# Altium schematic sheet MAIN.SchDoc
size A3; DocumentNumber: 1; SheetNumber: 1; SheetTotal: 2
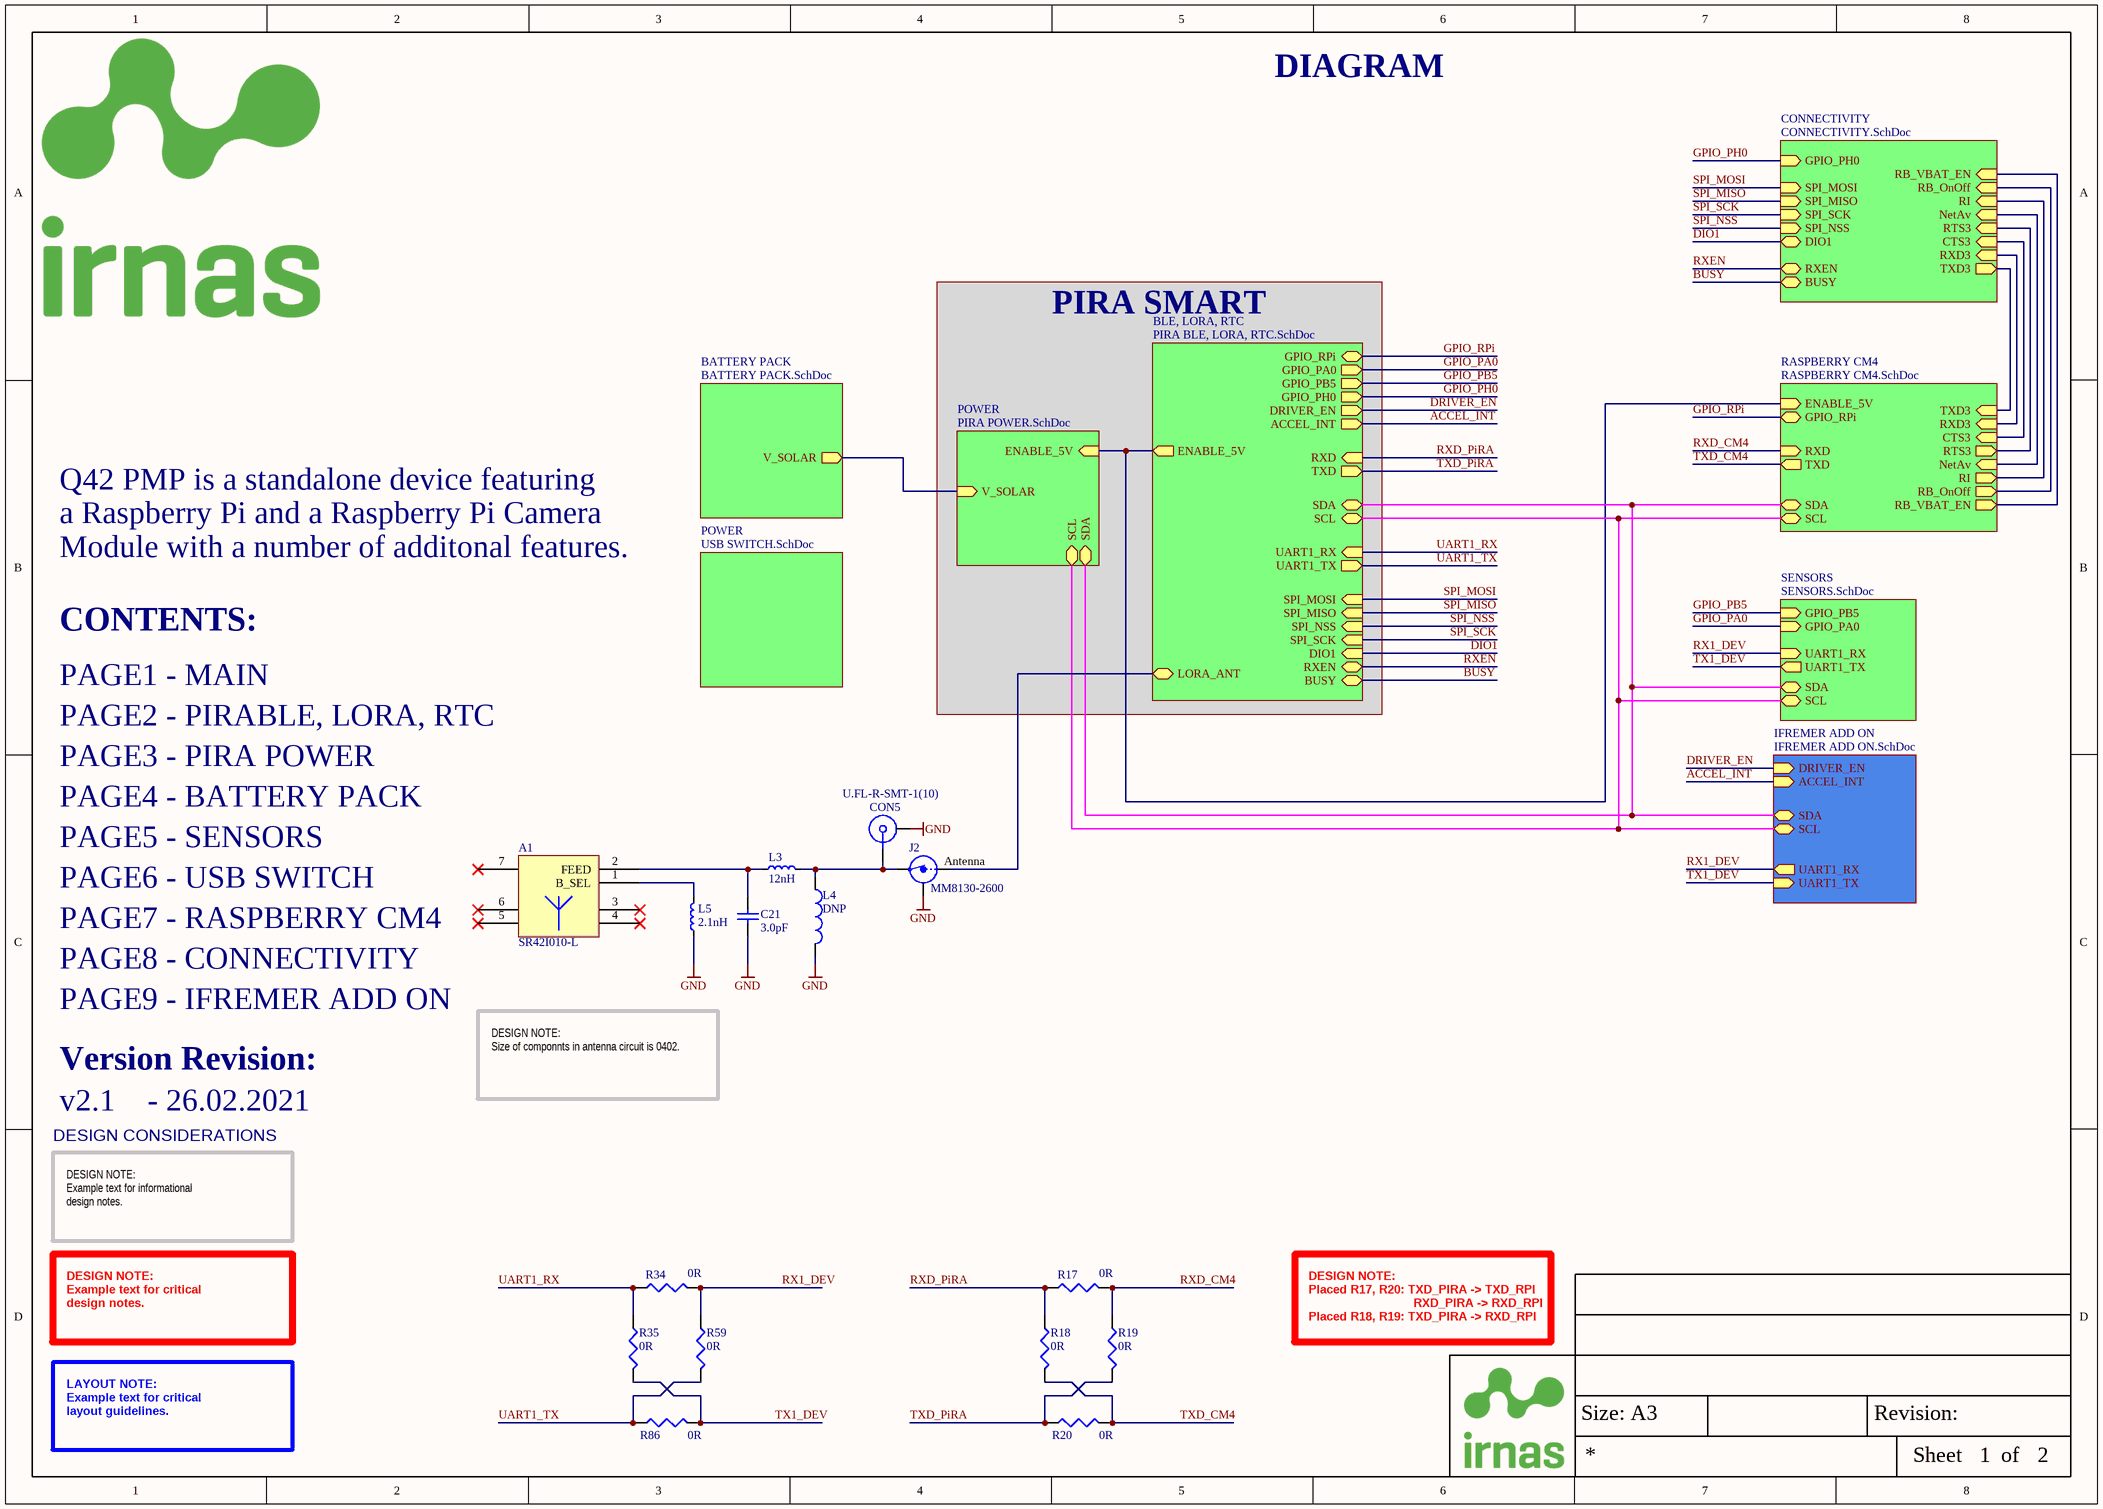
[diagram p0: MAIN.SchDoc]

## Parts
A1  SR42I010-L  [SR42I010-L]
C21  value 3.0pF  [CAP0402]  (hidden comment: 3.0pF/50V/0402)
CON5  U.FL-R-SMT-1(10)  [ufl connector smd]
J2  MM8130-2600  [COAXIAL-SWF]
L3  value 12nH  [IND0402]  (hidden comment: 10nH/0402)
L4  DNP  [IND0402]
L5  2.1nH  [IND0402]
R17  0R  [RES0603]
R18  0R  [RES0603]
R19  0R  [RES0603]
R20  0R  [RES0603]
R34  0R  [RES0603]
R35  0R  [RES0603]
R59  0R  [RES0603]
R86  0R  [RES0603]

## Sub-sheets
BATTERY PACK = BATTERY PACK.SchDoc: V_SOLAR (out)
BLE, LORA, RTC = PIRA BLE, LORA, RTC.SchDoc: ENABLE_5V (out), SDA (bidir), UART1_RX (in), SCL (bidir), UART1_TX (out), GPIO_PH0 (out), LORA_ANT (bidir), GPIO_PB5 (out), TXD (out), RXD (in), RXEN (bidir), BUSY (bidir), GPIO_PA0 (out), DRIVER_EN (out), ACCEL_INT (out), GPIO_RPi (bidir), SPI_SCK (in), SPI_MISO (in), DIO1 (in), SPI_MOSI (in), SPI_NSS (in)
CONNECTIVITY = CONNECTIVITY.SchDoc: TXD3 (out), RXD3 (in), GPIO_PH0 (in), RB_VBAT_EN (in), RI (in), CTS3 (in), NetAv (in), RXEN (bidir), RB_OnOff (in), BUSY (bidir), DIO1 (bidir), SPI_NSS (in), SPI_MISO (in), SPI_MOSI (in), RTS3 (in), SPI_SCK (in)
IFREMER ADD ON = IFREMER ADD ON.SchDoc: DRIVER_EN (in), UART1_TX (in), SCL (bidir), SDA (bidir), ACCEL_INT (in), UART1_RX (out)
POWER = PIRA POWER.SchDoc: ENABLE_5V (in), SCL (bidir), SDA (bidir), V_SOLAR (in)
POWER = USB SWITCH.SchDoc: no entries
RASPBERRY CM4 = RASPBERRY CM4.SchDoc: CTS3 (in), RB_OnOff (out), SDA (bidir), TXD (out), RTS3 (out), ENABLE_5V (in), TXD3 (in), RB_VBAT_EN (out), NetAv (in), RI (out), GPIO_RPi (bidir), RXD (in), SCL (bidir), RXD3 (in)
SENSORS = SENSORS.SchDoc: SDA (bidir), UART1_RX (in), SCL (bidir), GPIO_PB5 (in), GPIO_PA0 (in), UART1_TX (out)

## Nets
GND: C21.1 CON5.2 J2.2(Shield) L4.1 L5.1
ACCEL_INT: sheet BLE, LORA, RTC/ACCEL_INT, sheet IFREMER ADD ON/ACCEL_INT
BUSY: sheet BLE, LORA, RTC/BUSY, sheet CONNECTIVITY/BUSY
DIO1: sheet BLE, LORA, RTC/DIO1, sheet CONNECTIVITY/DIO1
DRIVER_EN: sheet BLE, LORA, RTC/DRIVER_EN, sheet IFREMER ADD ON/DRIVER_EN
GPIO_PA0: sheet SENSORS/GPIO_PA0, sheet BLE, LORA, RTC/GPIO_PA0
GPIO_PB5: sheet SENSORS/GPIO_PB5, sheet BLE, LORA, RTC/GPIO_PB5
GPIO_PH0: sheet BLE, LORA, RTC/GPIO_PH0, sheet CONNECTIVITY/GPIO_PH0
GPIO_RPi: sheet BLE, LORA, RTC/GPIO_RPi, sheet RASPBERRY CM4/GPIO_RPi
RX1_DEV: R34.2 R59.1 ; sheet SENSORS/UART1_RX, sheet IFREMER ADD ON/UART1_RX
RXD_CM4: R17.2 R19.1 ; sheet RASPBERRY CM4/RXD
RXD_PiRA: R17.1 R18.1 ; sheet BLE, LORA, RTC/RXD
RXEN: sheet BLE, LORA, RTC/RXEN, sheet CONNECTIVITY/RXEN
SPI_MISO: sheet BLE, LORA, RTC/SPI_MISO, sheet CONNECTIVITY/SPI_MISO
SPI_MOSI: sheet BLE, LORA, RTC/SPI_MOSI, sheet CONNECTIVITY/SPI_MOSI
SPI_NSS: sheet BLE, LORA, RTC/SPI_NSS, sheet CONNECTIVITY/SPI_NSS
SPI_SCK: sheet BLE, LORA, RTC/SPI_SCK, sheet CONNECTIVITY/SPI_SCK
TX1_DEV: R35.2 R86.2 ; sheet SENSORS/UART1_TX, sheet IFREMER ADD ON/UART1_TX
TXD_CM4: R18.2 R20.2 ; sheet RASPBERRY CM4/TXD
TXD_PiRA: R19.2 R20.1 ; sheet BLE, LORA, RTC/TXD
UART1_RX: R34.1 R35.1 ; sheet BLE, LORA, RTC/UART1_RX
UART1_TX: R59.2 R86.1 ; sheet BLE, LORA, RTC/UART1_TX
NetA1_1: A1.1(B_SEL) L5.2
NetA1_2: A1.2(FEED) C21.2 L3.1
NetCON5_1: CON5.1 J2.3(OUT) L3.2 L4.2
NetJ2_1: J2.1(IN) ; sheet BLE, LORA, RTC/LORA_ANT
(unnamed): sheet BATTERY PACK/V_SOLAR, sheet POWER/V_SOLAR
(unnamed): sheet SENSORS/SDA, sheet POWER/SDA, sheet BLE, LORA, RTC/SDA, sheet IFREMER ADD ON/SDA, sheet RASPBERRY CM4/SDA
(unnamed): sheet SENSORS/SCL, sheet POWER/SCL, sheet BLE, LORA, RTC/SCL, sheet IFREMER ADD ON/SCL, sheet RASPBERRY CM4/SCL
(unnamed): sheet POWER/ENABLE_5V, sheet BLE, LORA, RTC/ENABLE_5V, sheet RASPBERRY CM4/ENABLE_5V
(unnamed): sheet CONNECTIVITY/TXD3, sheet RASPBERRY CM4/TXD3
(unnamed): sheet CONNECTIVITY/RXD3, sheet RASPBERRY CM4/RXD3
(unnamed): sheet CONNECTIVITY/RB_VBAT_EN, sheet RASPBERRY CM4/RB_VBAT_EN
(unnamed): sheet CONNECTIVITY/RI, sheet RASPBERRY CM4/RI
(unnamed): sheet CONNECTIVITY/CTS3, sheet RASPBERRY CM4/CTS3
(unnamed): sheet CONNECTIVITY/NetAv, sheet RASPBERRY CM4/NetAv
(unnamed): sheet CONNECTIVITY/RB_OnOff, sheet RASPBERRY CM4/RB_OnOff
(unnamed): sheet CONNECTIVITY/RTS3, sheet RASPBERRY CM4/RTS3

Not connected (* = marked no-connect by the designer): A1 3* 4* 5* 6* 7*

## Notes on the sheet
- DIAGRAM
- PIRA SMART
- Q42 PMP is a standalone device featuring
- a Raspberry Pi and a Raspberry Pi Camera
- Module with a number of additonal features.
- CONTENTS:
- PAGE1 - MAIN
- PAGE2 - PIRABLE, LORA, RTC
- PAGE3 - PIRA POWER
- PAGE4 - BATTERY PACK
- PAGE5 - SENSORS
- PAGE6 - USB SWITCH
- PAGE7 - RASPBERRY CM4
- PAGE8 - CONNECTIVITY
- PAGE9 - IFREMER ADD ON
- Version Revision:
- v2.1    - 26.02.2021
- DESIGN NOTE:
  Size of componnts in antenna circuit is 0402.
- DESIGN CONSIDERATIONS
- DESIGN NOTE:
  Example text for informational
  design notes.
- DESIGN NOTE:
  Example text for critical
  design notes.
- DESIGN NOTE:
  Placed R17, R20: TXD_PIRA -> TXD_RPI
  RXD_PIRA -> RXD_RPI
  Placed R18, R19: TXD_PIRA -> RXD_RPI
  RXD_PIRA -> TXD_RPI
- LAYOUT NOTE:
  Example text for critical
  layout guidelines.
- Size: A3
- Revision:
- Sheet
- of
- (in symbol Coaxial-Internal-SW) Antenna

## Library data of the parts
A1 = ANT - SR42I010-R_1: Antenna SMD -4dBi Gain 870MHz/928MHz Automotive 7-Pin SMD T/R; Manufacturer: Antenova; Supplier 1: Mouser; Manufacturer Part Number: SR42I010-R; Stock 1: 3154; Pricing 1: 1 = 2.36000, 10 = 1.90000, 50 = 1.90000, 100 = 1.52000, 1000 = 1.07000, 10000 = 0.95900 (USD); Supplier Part Number 1: 237-SR42I010-R
C21 = C - 3.0pF/50V/0402: CAP CER 3.0PF 50V C0G/NP0 0402; Published: 8-Jun-2000; LatestRevisionDate: 05-oct-2007  -  Semtech; LatestRevisionNote: Re-released for DXP Platform.; Publisher: Altium Limited; Supplier 1: Digi-Key; Supplier Part Number 1: 490-7756-1-ND
CON5 = U.FL-R-SMT-1(10): RF / Coaxial Connector, U.FL Coaxial, Straight Jack, Surface Mount Vertical, 50 ohm, Brass; Manufacturer: Hirose; Featured Product: U.FL Series Connectors; Connector Style: U.FL, Ultra Miniature Coaxial; Connector Type: Receptacle, Male Pin; Contact Termination: Solder; Impedance: 50 Ohm; Frequency - Max: 6GHz; Body Material: Phosphor Bronze; Body Finish: Silver; Center Contact Plating: Gold; Dielectric Material: Liquid Crystal Polymer (LCP); Online Catalog: UMCC (Ultra Miniature Coax Connectors), U.FL Series; Other Names: H11891TR  Q5400621  U.FL-R-SMT-1 10  U.FL-R-SMT-1(10)-ND  UFLRSMT110; Supplier 1: Farnell; Manufacturer Part Number: U.FL-R-SMT-1(10); Stock 1: 0; Standard Package: 2,500; Category: Connectors, Interconnects; Family: Coaxial Connectors (RF); Series: U.FL; Packaging: Tape & Reel (TR); Shield Termination: Solder; Mounting Type: Surface Mount; Cable Group: -; Fastening Type: Snap-On; Features: -; Housing Color: Beige; Ingress Protection: -; Center Contact Material: Brass; Voltage Rating: -; Operating Temperature: -40°C ~ 90°C; ComponentLink1URL: http://www.farnell.com/datasheets/91524.pdf; ComponentLink1Description: http://www.farnell.com/datasheets/91524.pdf; ComponentLink2URL: http://uk.rs-online.com/webdocs/1363/0900766b81363563.pdf; ComponentLink2Description: http://uk.rs-online.com/webdocs/1363/0900766b81363563.pdf; ComponentLink3URL: http://www.farnell.com/datasheets/1947917.pdf; ComponentLink3Description: http://www.farnell.com/datasheets/1947917.pdf; Supplier Part Number 1: 1688077
J2 = Coaxial-Internal-SW: Coaxial Connector with Switch; Manufacturer: Murata; 2nd source part number: 81-MM8130-2600RA2; Artikkelnr Noca: 55029011; Artikkelnr Simpro: N.A.; Part Number: MM8130-2600; Manufacturer Part Number: MM8130-2600; Datasheet: http://www.murata.com/products/catalog/pdf/o33e.pdf; LatestRevisionDate: 2014-04-24; Pin Count: 3; Publisher: Nordic Semiconductor; Published: 2014-04-24; Value: MM8130-2600; Note: *; Supplier: Digi-Key; Supplier part number: 490-4981-1-ND; 2nd source Supplier: Mouser; Footprint Doc: COAXIAL-SWF
L3 = L - 12nH/500mA/0402: IND 12NH 500MA 280 MOHM; Code_IEC: 1005; Published: 8-Jun-2000; LatestRevisionDate: 05-oct-2007  -  Semtech; LatestRevisionNote: Re-released for DXP Platform.; Publisher: Altium Limited; Code_JEITA: 0402; Supplier 1: Digi-Key; Supplier Part Number 1: 490-2624-1-ND
L4 = L - 4.3nH/0402: Inductor RF Chip Multi-Layer 4.3nH 0.3nH 100MHz 8Q-Factor Air 300mA 210mOhm DCR 0402 Paper T/R; Manufacturer: Murata; Manufacturer Part Number: LQG15HN4N3S02D; IRNAS Part No.: /; Q Factor: 8; Self Resonant Frequency: 6GHz; Shielding: Unshielded; DC Resistance (DCR): 210mR; Stock 1: 3502; Pricing 1: 1 = 0.10000, 10 = 0.06100, 100 = 0.04040, 500 = 0.03366, 1000 = 0.02827, 2500 = 0.02423 (USD); RoHS: Yes; Mount: Surface Mount; Case/Package: 0402; Core Material: Air; Case Code (Metric): 1005; Case Code (Imperial): 0402; Min Operating Temperature: -55°C; Max Operating Temperature: 125°C; Package Quantity: 10000; Packaging: Tape and Reel; Current Rating: 300mA; Inductance: 4.3nh; Test Frequency: 100MHz; Max DC Current: 300mA; Termination: SMD/SMT; Current: 300mA; DC Current: 300mA; Military Standard: Not; Length: 1.05mm; Height: 0.5mm; Width: 0.02inch; Height - Seated (Max): 0.022inch; Depth: 0.55mm; Radiation Hardening: No; REACH SVHC: No SVHC; Lead Free: Lead Free; ComponentLink1URL: http://uk.rs-online.com/webdocs/0f10/0900766b80f10808.pdf?src-supplier=RSComponents; ComponentLink1Description: http://uk.rs-online.com/webdocs/0f10/0900766b80f10808.pdf?src-supplier=RSComponents; ComponentLink2URL: http://search.murata.co.jp/Ceramy/image/img/PDF/ENG/L0075S0083LQG15HN.pdf?src-supplier=Avnet; ComponentLink2Description: http://search.murata.co.jp/Ceramy/image/img/PDF/ENG/L0075S0083LQG15HN.pdf?src-supplier=Avnet; ComponentLink3URL: http://www.farnell.com/datasheets/66026.pdf?src-supplier=Element14; ComponentLink3Description: http://www.farnell.com/datasheets/66026.pdf?src-supplier=Element14; ComponentLink4URL: https://www.verical.com/server-webapp/html/getDatasheet?partID=31252&src-supplier=Verical; ComponentLink4Description: https://www.verical.com/server-webapp/html/getDatasheet?partID=31252&src-supplier=Verical; ComponentLink5URL: http://search.murata.co.jp/Ceramy/image/img/PDF/ENG/L0075S0083LQG15HN.pdf?src-supplier=Avnet+Europe; ComponentLink5Description: http://search.murata.co.jp/Ceramy/image/img/PDF/ENG/L0075S0083LQG15HN.pdf?src-supplier=Avnet+Europe; ComponentLink6URL: https://search.murata.co.jp/Ceramy/image/img/P02/partnumberingAT_LQ3E.pdf?src-supplier=Digi-Key; ComponentLink6Description: https://search.murata.co.jp/Ceramy/image/img/P02/partnumberingAT_LQ3E.pdf?src-supplier=Digi-Key; Supplier 1: Farnell; Supplier Part Number 1: 1711735
L5 = L - 2.1nH/0402: Multilayer Inductor, AEC-Q200, 2.1 nH, 0.06 ohm, 8 GHz, 1 A, 0402 [1005 Metric], LQG15WH_02 Series; Supplier 1: Farnell; Supplier Part Number 1: 3263552
R17-R20 R34 R35 R59 R86 = R - 0R: BOURNS - CR0603-J/-000ELF - RES, THICK FILM, 0R, 5%, 0.1W, 0603; IRNAS Part No.: I-100011; Resistance: 0; Voltage Rating: 50; Resistor Case Style: 0603 [1608 Metric]; Power Rating: 100; Product Range: CR Series; SVHC: No SVHC (17-Dec-2015); Resistor Mounting: Surface Mount Device<!--FANDB--><div class="features-and-benefits-container"><div class="features-and-benefits-description"><span class="features-benefits-value">The Bourns CR series are standard thick film chip resistors. These resistors provide flexibility of performance, space saving and low cost. The Resistance range includes E96 and E24 decade values from 1ohm to 10Mohm.</span></div><div class="features-and-benefits-list"><ul class="features-and-benefits-list-list"><li class="features-and-benefits-list-item">0201, 0402, 0603, 0805, 1206, 1210, 2010, 2512 standard case sizes available</li><li class="features-and-benefits-list-item">±1% and ±5% tolerance</li><li class="features-and-benefits-list-item">±100ppm/°C, ±200ppm/°C and ±250ppm/°C TCR values available</li><li class="features-and-benefits-list-item">Power rating selectable for 50mW, 63mW, 0.1W, 0.125W, 0.25W, 0.5W and 1W based on ordering</li><li class="features-and-benefits-list-item">Jumpers are available for all size</li><li class="features-and-benefits-list-item">3 layer termination process with nickel barrier prevents leaching & provides excellent solderability</li><li class="features-and-benefits-list-item">Suitable for all type of soldering processes</li><li class="features-and-benefits-list-item">Tight dimensional tolerances</li><li class="features-and-benefits-list-item">Maximum working voltage depends on case size</li><li class="features-and-benefits-list-item">Operating temperature of -55°C to +125°C(CR0201) and -55°C to +155; Supplier 1: Farnell; Manufacturer: BOURNS; Manufacturer Part Number: CR0603-J/-000ELF; RoHS: YES; Stock 1: 58200; Pricing 1: 10=0.0146, 250=0.0097, 1000=0.0073, 5000=0.0049, 12500=0.0042 (GBP); Resistance Tolerance: ± 5%; Packaging: Cut Tape; Resistor Element Material: Thick Film; Temperature Coefficient: -; Automotive Qualification Standard: -; MSL: MSL 1 - Unlimited; ComponentLink1URL: http://www.bourns.com/engineering/CHPREZTR/cr0603.stp; ComponentLink1Description: http://www.bourns.com/engineering/CHPREZTR/cr0603.stp; ComponentLink2URL: http://www.farnell.com/datasheets/2178762.pdf; ComponentLink2Description: http://www.farnell.com/datasheets/2178762.pdf; Supplier Part Number 1: 2008343